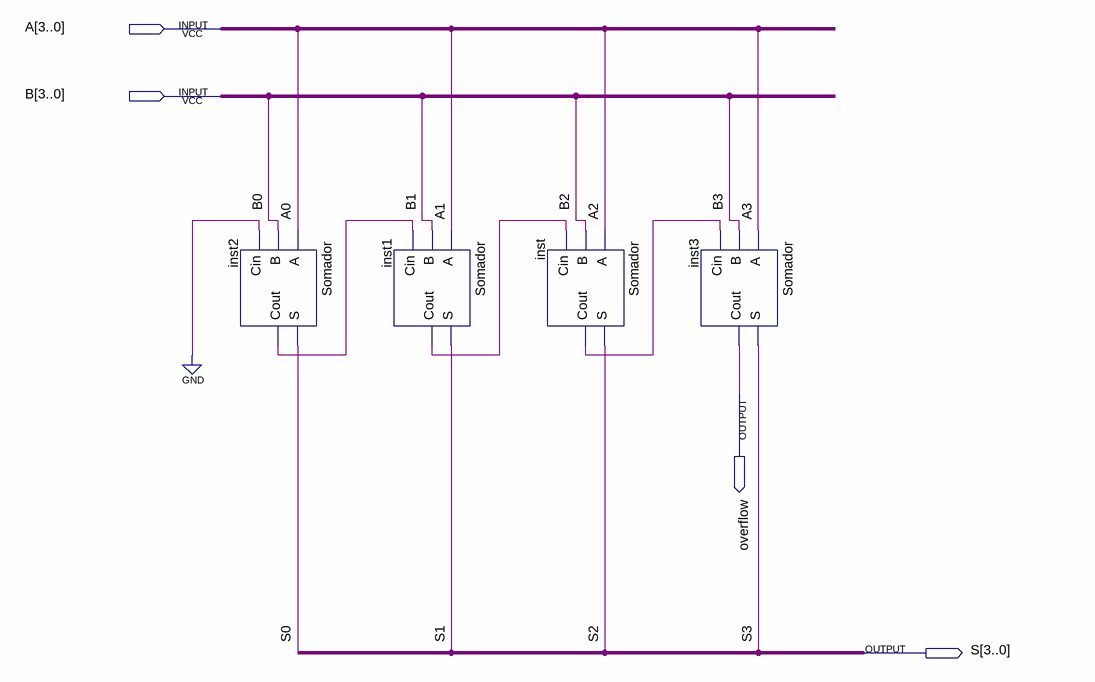
[diagram p0: schematic sheet]
// Quartus schematic Subtrator4Bits.bdf as structural Verilog: 4 symbols, 4 pins
module Subtrator4Bits (
  input  [3:0] A,
  input  [3:0] B,
  output overflow,
  output [3:0] S
);

  wire inst1_cout, inst2_cout, inst_cout;

  Somador inst2 (.A(A[0]), .B(B[0]), .Cin(1'b0), .S(S[0]), .Cout(inst2_cout));
  Somador inst1 (.A(A[1]), .B(B[1]), .Cin(inst2_cout), .S(S[1]), .Cout(inst1_cout));
  Somador inst (.A(A[2]), .B(B[2]), .Cin(inst1_cout), .S(S[2]), .Cout(inst_cout));
  Somador inst3 (.A(A[3]), .B(B[3]), .Cin(inst_cout), .S(S[3]), .Cout(overflow));
endmodule
